# EAGLE design vape_v3_logic (EAGLE 9.0.0)

## Sheet 1 of 7: Notes
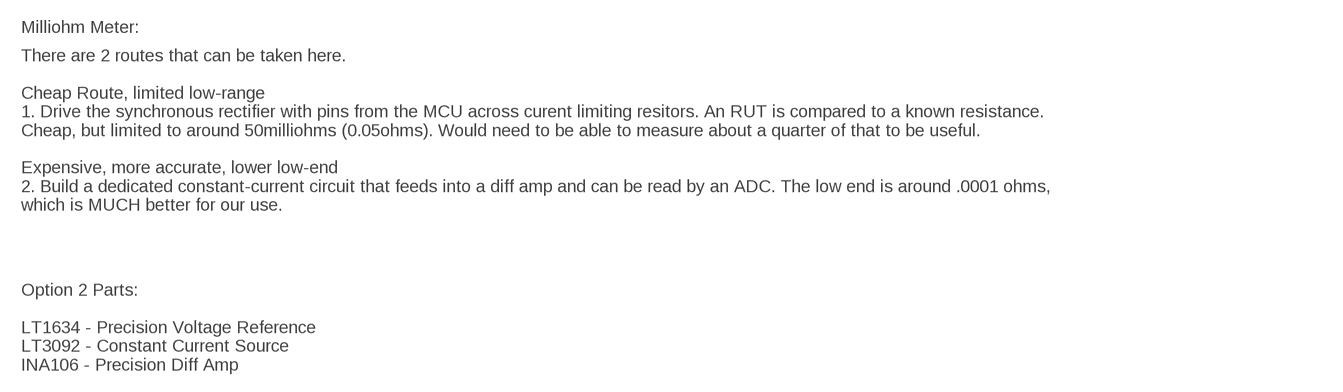
[diagram p0: schematic, sheet 1]

### Notes on the sheet
- Milliohm Meter:
- There are 2 routes that can be taken here. 
  
  Cheap Route, limited low-range
  1. Drive the synchronous rectifier with pins from the MCU across curent limiting resitors. An RUT is compared to a known resistance. 
  Cheap, but limited to around 50milliohms (0.05ohms). Would need to be able to measure about a quarter of that to be useful.
  
  Expensive, more accurate, lower low-end
  2. Build a dedicated constant-current circuit that feeds into a diff amp and can be read by an ADC. The low end is around .0001 ohms, 
  which is MUCH better for our use.
- Option 2 Parts:
  
  LT1634 - Precision Voltage Reference
  LT3092 - Constant Current Source
  INA106 - Precision Diff Amp

## Sheet 2 of 7: 5V Rail
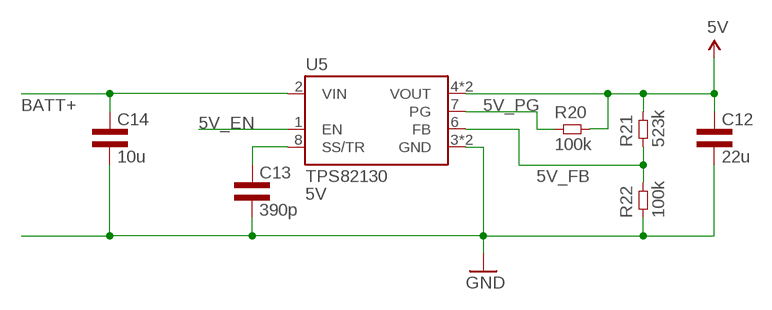
[diagram p1: schematic, sheet 2]

### Parts
C12  22u  CAP1206L3  [1206L3]
C13  390p  CAP0603L3  [0603L3]
C14  10u  CAP0805L3  [0805L3]
R20  100k  RES0805L3  [0805L3]
R21  523k  RES0603L3  [0603L3]
R22  100k  RES0603L3  [0603L3]
U5  TPS82130  [SIL0008D]

### Nets
5V: C12.1 R20.2 R21.P$2 U5.4(VOUT) U5.5(VOUT)
5V_EN: U5.1(EN)
5V_FB: R21.P$1 R22.P$2 U5.6(FB)
5V_PG: R20.1 U5.7(PG)
5V_SS: C13.P$1 U5.8(SS/TR)
BATT+: C14.1 U5.2(VIN) ; also sheet 3,7
GND: C12.2 C13.P$2 C14.2 R22.P$1 U5.3(GND) U5.TP(GND) ; also sheet 3,4,5,6,7

## Sheet 3 of 7: 3V3 Rail
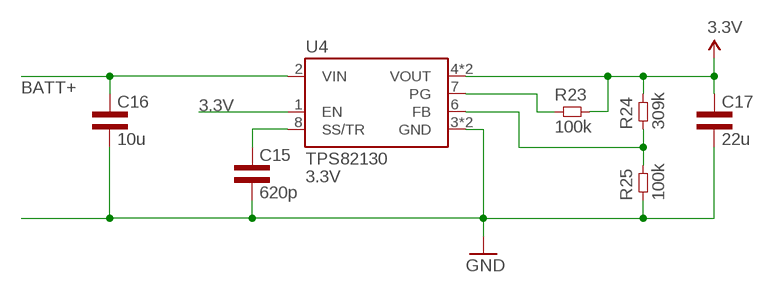
[diagram p2: schematic, sheet 3]

### Parts
C15  620p  CAP0603L3  [0603L3]
C16  10u  CAP0805L3  [0805L3]
C17  22u  CAP1206L3  [1206L3]
R23  100k  RES0805L3  [0805L3]
R24  309k  RES0603L3  [0603L3]
R25  100k  RES0603L3  [0603L3]
U4  TPS82130  [SIL0008D]

### Nets
3.3V: C17.1 R23.2 R24.P$2 U4.1(EN) U4.4(VOUT) U4.5(VOUT) ; also sheet 4,6
BATT+: C16.1 U4.2(VIN) ; also sheet 2,7
GND: C15.P$2 C16.2 C17.2 R25.P$1 U4.3(GND) U4.TP(GND) ; also sheet 2,4,5,6,7
N$7: R23.1 U4.7(PG)
N$9: R24.P$1 R25.P$2 U4.6(FB)
N$12: C15.P$1 U4.8(SS/TR)

## Sheet 4 of 7
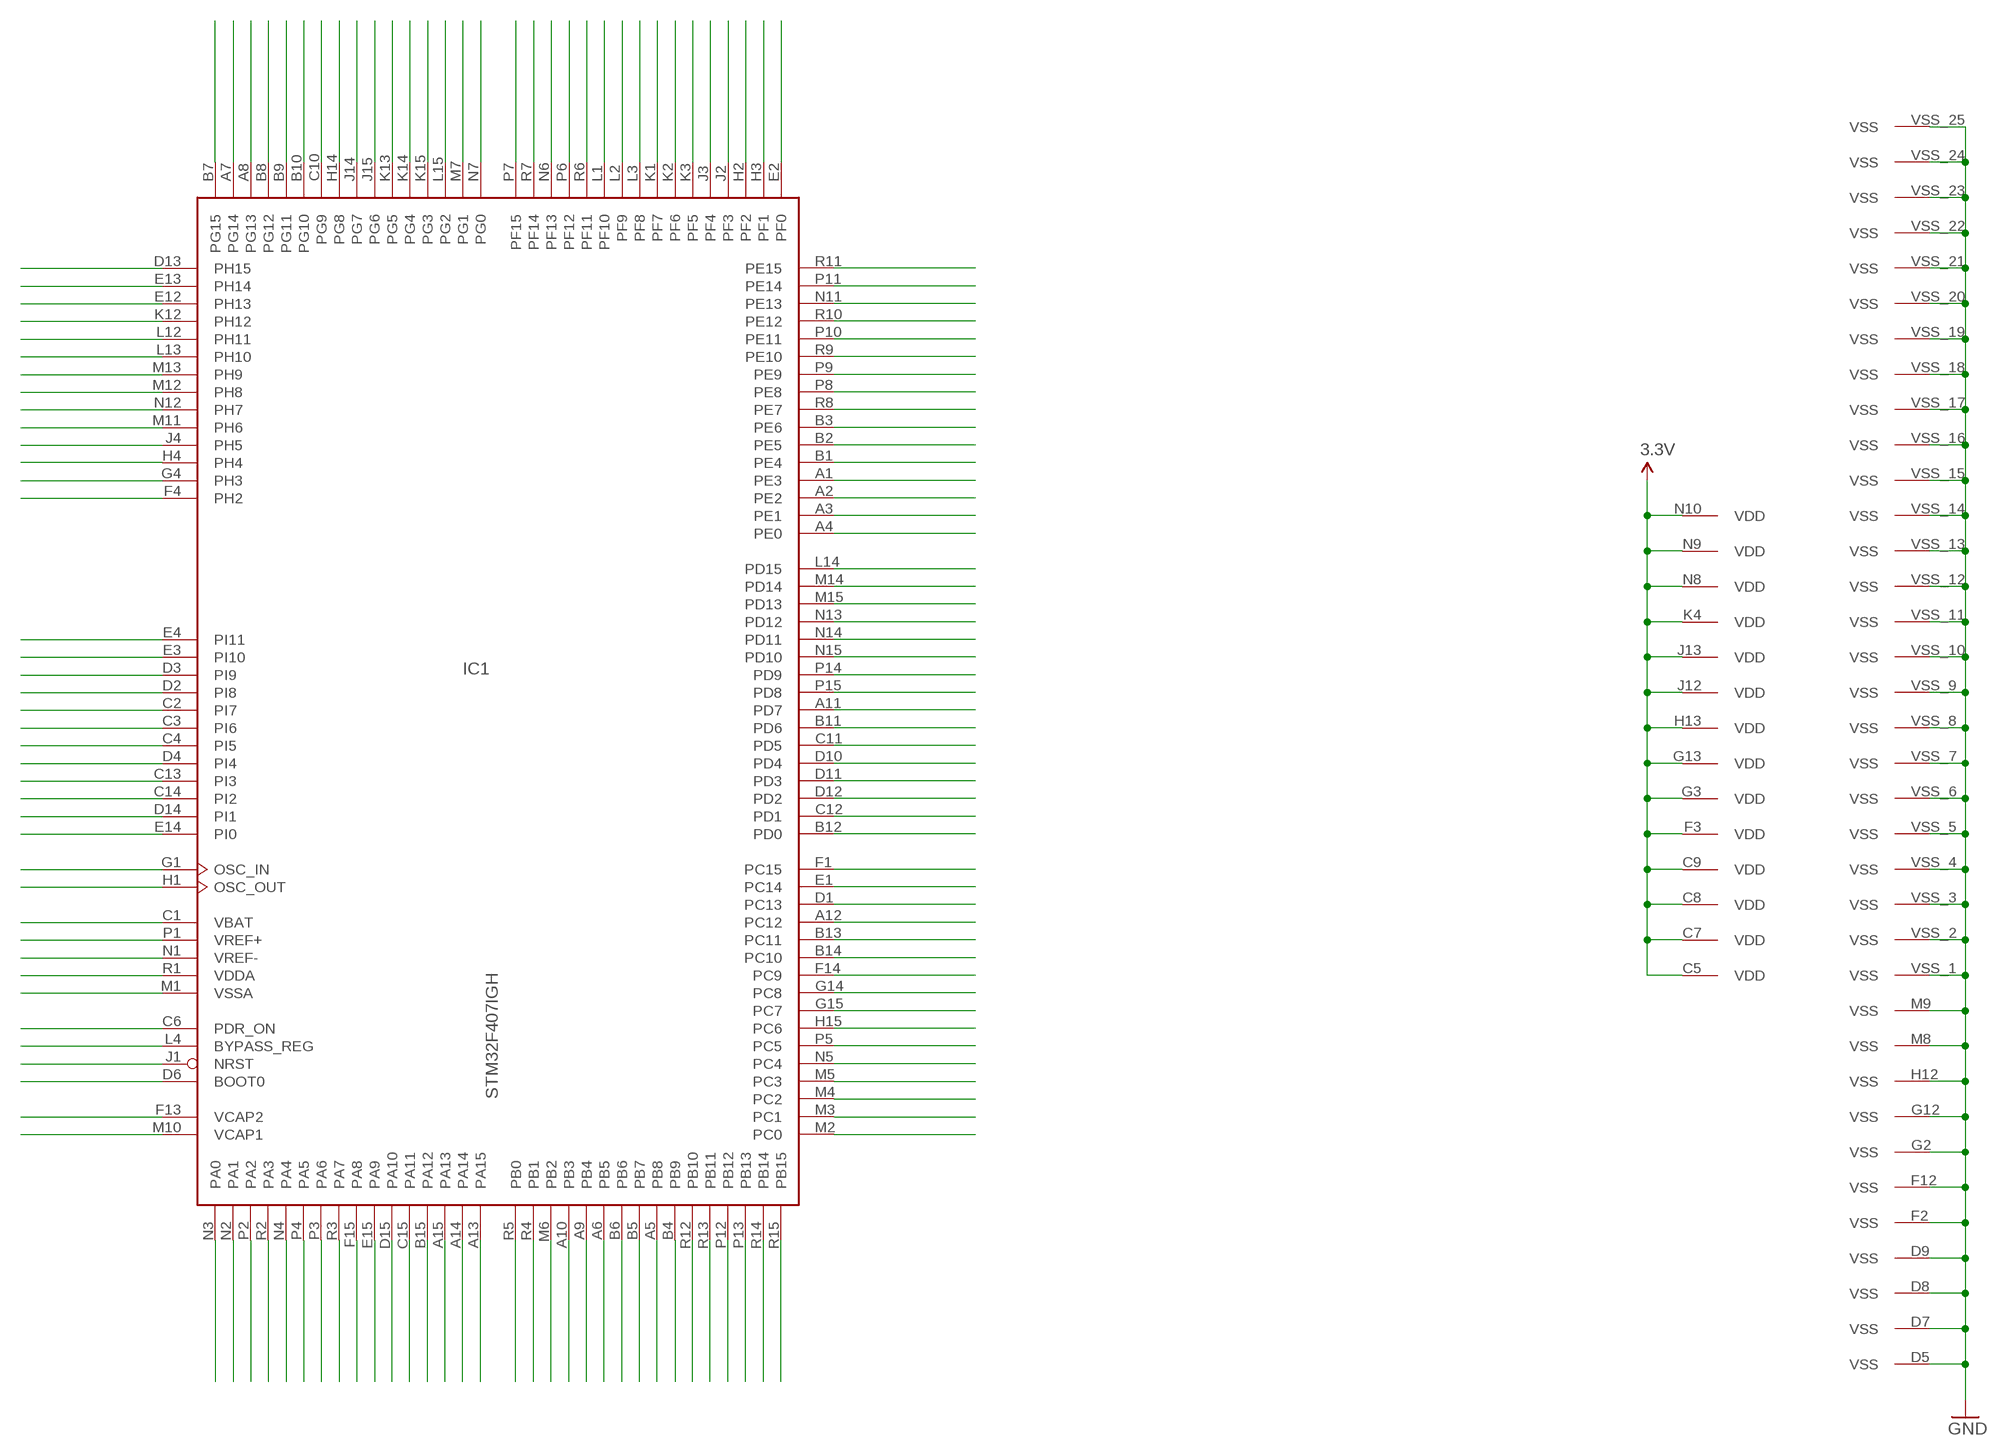
[diagram p3: schematic, sheet 4]

### Parts
IC1  STM32F407IGH  [UFBGA176+25]

### Nets
3.3V: IC1.C5(VDD) IC1.C7(VDD) IC1.C8(VDD) IC1.C9(VDD) IC1.F3(VDD) IC1.G3(VDD) IC1.G13(VDD) IC1.H13(VDD) IC1.J12(VDD) IC1.J13(VDD) IC1.K4(VDD) IC1.N8(VDD) IC1.N9(VDD) IC1.N10(VDD) ; also sheet 3,6
GND: IC1.D5(VSS) IC1.D7(VSS) IC1.D8(VSS) IC1.D9(VSS) IC1.F2(VSS) IC1.F12(VSS) IC1.G2(VSS) IC1.G12(VSS) IC1.H12(VSS) IC1.M8(VSS) IC1.M9(VSS) IC1.VSS_1(VSS) IC1.VSS_2(VSS) IC1.VSS_3(VSS) IC1.VSS_4(VSS) IC1.VSS_5(VSS) IC1.VSS_6(VSS) IC1.VSS_7(VSS) IC1.VSS_8(VSS) IC1.VSS_9(VSS) IC1.VSS_10(VSS) IC1.VSS_11(VSS) IC1.VSS_12(VSS) IC1.VSS_13(VSS) IC1.VSS_14(VSS) IC1.VSS_15(VSS) IC1.VSS_16(VSS) IC1.VSS_17(VSS) IC1.VSS_18(VSS) IC1.VSS_19(VSS) IC1.VSS_20(VSS) IC1.VSS_21(VSS) IC1.VSS_22(VSS) IC1.VSS_23(VSS) IC1.VSS_24(VSS) IC1.VSS_25(VSS) ; also sheet 2,3,5,6,7
N$8: IC1.P14(PD9)
N$11: IC1.N15(PD10)
N$13: IC1.N14(PD11)
N$17: IC1.N13(PD12)
N$18: IC1.M15(PD13)
N$22: IC1.M14(PD14)
N$24: IC1.L14(PD15)
N$25: IC1.P15(PD8)
N$26: IC1.A11(PD7)
N$27: IC1.B11(PD6)
N$29: IC1.C11(PD5)
N$30: IC1.D10(PD4)
N$33: IC1.D11(PD3)
N$34: IC1.D12(PD2)
N$35: IC1.C12(PD1)
N$36: IC1.B12(PD0)
N$37: IC1.F1(PC15)
N$38: IC1.E1(PC14)
N$39: IC1.D1(PC13)
N$40: IC1.A12(PC12)
N$41: IC1.B13(PC11)
N$42: IC1.B14(PC10)
N$43: IC1.F14(PC9)
N$44: IC1.G14(PC8)
N$45: IC1.G15(PC7)
N$46: IC1.H15(PC6)
N$47: IC1.P5(PC5)
N$48: IC1.N5(PC4)
N$49: IC1.M5(PC3)
N$50: IC1.M4(PC2)
N$51: IC1.M3(PC1)
N$52: IC1.M2(PC0)
N$53: IC1.A4(PE0)
N$54: IC1.A3(PE1)
N$55: IC1.A2(PE2)
N$56: IC1.A1(PE3)
N$57: IC1.B1(PE4)
N$58: IC1.B2(PE5)
N$59: IC1.B3(PE6)
N$60: IC1.R8(PE7)
N$61: IC1.P8(PE8)
N$62: IC1.P9(PE9)
N$63: IC1.R9(PE10)
N$64: IC1.P10(PE11)
N$65: IC1.R10(PE12)
N$66: IC1.N11(PE13)
N$67: IC1.P11(PE14)
N$68: IC1.R11(PE15)
N$69: IC1.R15(PB15)
N$70: IC1.R14(PB14)
N$71: IC1.P13(PB13)
N$72: IC1.P12(PB12)
N$73: IC1.R13(PB11)
N$74: IC1.R12(PB10)
N$75: IC1.B4(PB9)
N$76: IC1.A5(PB8)
N$77: IC1.B5(PB7)
N$78: IC1.B6
N$79: IC1.A6(PB5)
N$80: IC1.A9(PB4)
N$81: IC1.A10(PB3)
N$82: IC1.M6(PB2)
N$83: IC1.R4(PB1)
N$84: IC1.R5(PB0)
N$85: IC1.A13(PA15)
N$86: IC1.A14
N$87: IC1.A15(PA13)
N$88: IC1.B15(PA12)
N$89: IC1.C15(PA11)
N$90: IC1.D15(PA10)
N$91: IC1.E15(PA9)
N$92: IC1.F15(PA8)
N$93: IC1.R3(PA7)
N$94: IC1.P3(PA6)
N$95: IC1.P4(PA5)
N$96: IC1.N4(PA4)
N$97: IC1.R2(PA3)
N$98: IC1.P2(PA2)
N$99: IC1.N2(PA1)
N$100: IC1.N3(PA0)
N$101: IC1.M10(VCAP1)
N$102: IC1.F13(VCAP2)
N$103: IC1.D6(BOOT0)
N$104: IC1.J1(NRST)
N$105: IC1.L4(BYPASS_REG)
N$106: IC1.C6(PDR_ON)
N$107: IC1.M1(VSSA)
N$108: IC1.R1(VDDA)
N$109: IC1.N1(VREF-)
N$110: IC1.P1(VREF+)
N$111: IC1.C1(VBAT)
N$112: IC1.H1(OSC_OUT)
N$113: IC1.G1(OSC_IN)
N$114: IC1.E14(PI0)
N$115: IC1.D14(PI1)
N$116: IC1.C14(PI2)
N$117: IC1.C13(PI3)
N$118: IC1.D4(PI4)
N$119: IC1.C4(PI5)
N$120: IC1.C3(PI6)
N$121: IC1.C2(PI7)
N$122: IC1.D2(PI8)
N$123: IC1.D3(PI9)
N$124: IC1.E3(PI10)
N$125: IC1.E4(PI11)
N$126: IC1.F4(PH2)
N$127: IC1.G4(PH3)
N$128: IC1.H4
N$129: IC1.J4(PH5)
N$130: IC1.M11(PH6)
N$131: IC1.N12(PH7)
N$132: IC1.M12(PH8)
N$133: IC1.M13(PH9)
N$134: IC1.L13(PH10)
N$135: IC1.L12(PH11)
N$136: IC1.K12(PH12)
N$137: IC1.E12(PH13)
N$138: IC1.E13(PH14)
N$139: IC1.D13(PH15)
N$140: IC1.E2(PF0)
N$141: IC1.H3(PF1)
N$142: IC1.H2(PF2)
N$143: IC1.J2(PF3)
N$144: IC1.J3(PF4)
N$145: IC1.K3(PF5)
N$146: IC1.K2(PF6)
N$147: IC1.K1(PF7)
N$148: IC1.L3(PF8)
N$149: IC1.L2(PF9)
N$150: IC1.L1(PF10)
N$151: IC1.R6(PF11)
N$152: IC1.P6(PF12)
N$153: IC1.N6(PF13)
N$154: IC1.R7(PF14)
N$155: IC1.P7(PF15)
N$156: IC1.N7(PG0)
N$157: IC1.M7(PG1)
N$158: IC1.L15(PG2)
N$159: IC1.K15(PG3)
N$160: IC1.K14(PG4)
N$161: IC1.K13(PG5)
N$162: IC1.J15(PG6)
N$163: IC1.J14(PG7)
N$164: IC1.H14(PG8)
N$165: IC1.C10(PG9)
N$166: IC1.B10(PG10)
N$167: IC1.B9(PG11)
N$168: IC1.B8(PG12)
N$169: IC1.A8(PG13)
N$170: IC1.A7(PG14)
N$171: IC1.B7(PG15)

## Sheet 5 of 7: Milliohm Meter
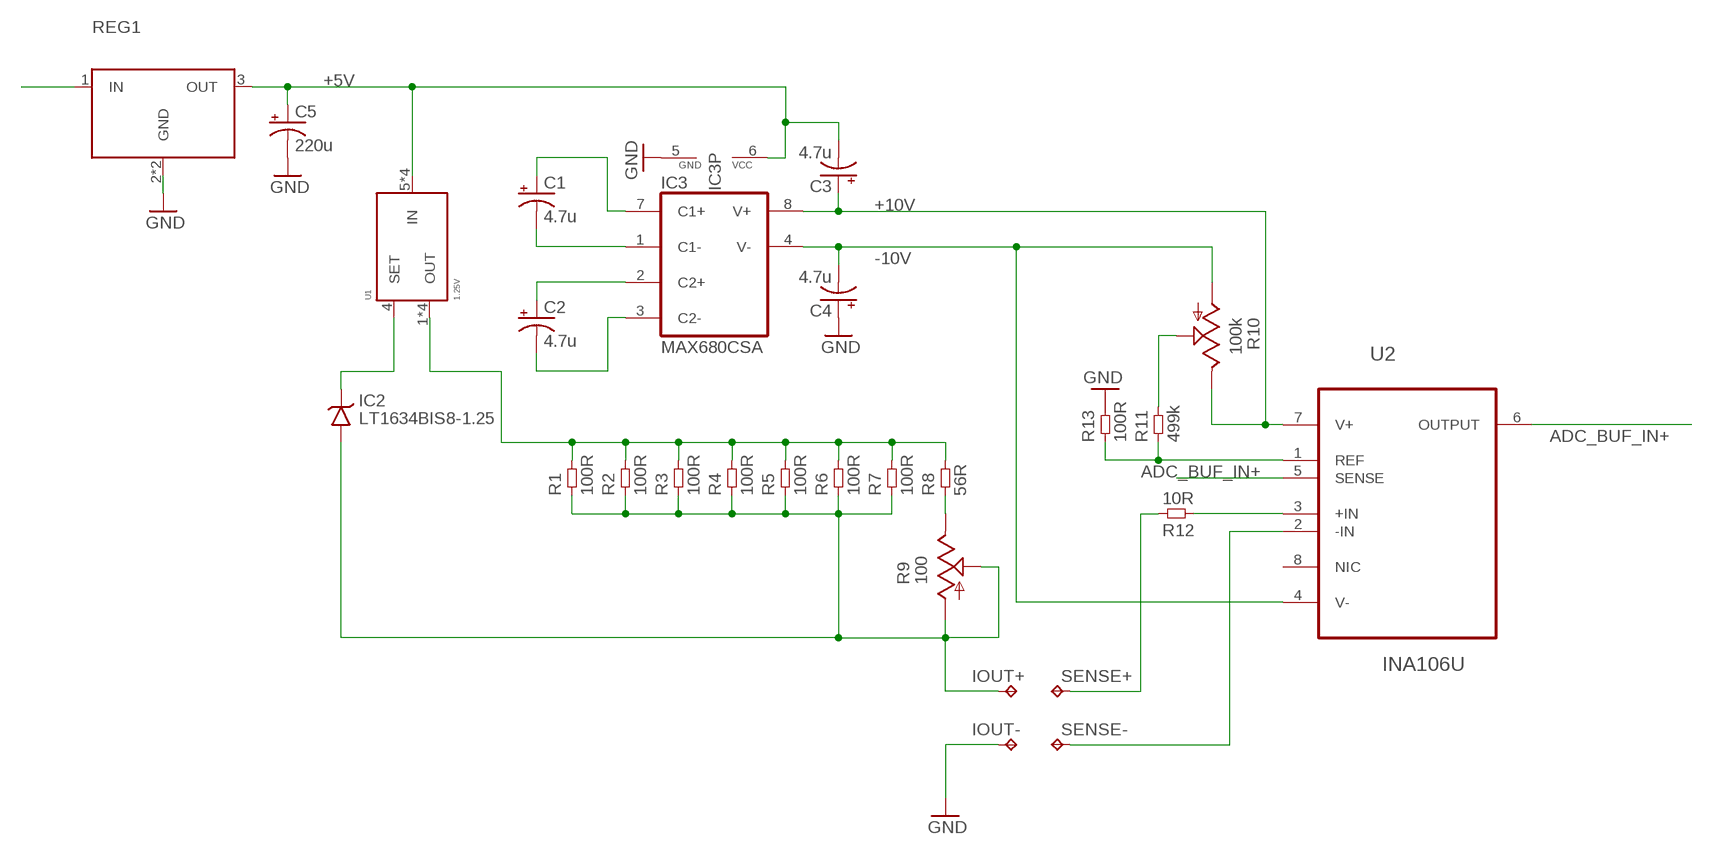
[diagram p4: schematic, sheet 5]

### Parts
C1  4.7u  CPOL-USB/3528-21R  [B/3528-21R]
C2  4.7u  CPOL-USB/3528-21R  [B/3528-21R]
C3  4.7u  CPOL-USB/3528-21R  [B/3528-21R]
C4  4.7u  CPOL-USB/3528-21R  [B/3528-21R]
C5  220u  CPOL-USC  [PANASONIC_C]
IC2  LT1634BIS8-1.25  [S8]
IC3  MAX680CSA  [SO08]
IOUT+  TPPAD1-17  [P1-17]
IOUT-  TPPAD1-17  [P1-17]
R1  100R  RES0603L3  [0603L3]
R2  100R  RES0603L3  [0603L3]
R3  100R  RES0603L3  [0603L3]
R4  100R  RES0603L3  [0603L3]
R5  100R  RES0603L3  [0603L3]
R6  100R  RES0603L3  [0603L3]
R7  100R  RES0603L3  [0603L3]
R8  56R  RES0603L3  [0603L3]
R9  100  TRIM_US-3223W  [3223W]
R10  100k  TRIM_US-3223W  [3223W]
R11  499k  RES0603L3  [0603L3]
R12  10R  RES0603L3  [0603L3]
R13  100R  RES0603L3  [0603L3]
REG1  LDO_REG_4PIN  [SOT-223-3]
SENSE+  TPPAD1-17  [P1-17]
SENSE-  TPPAD1-17  [P1-17]
U1  1.25V  LT3092  [DD-8]
U2  INA106U  [SOIC127P600X175-8N]

### Nets
+5V: C3.- C5.+ IC3.6(VCC) REG1.3(OUT) U1.5(IN) U1.6(IN) U1.7(IN) U1.8(IN)
+10V: C3.+ IC3.8(V+) R10.3(E) U2.7(V+)
-10V: C4.- IC3.4(V-) R10.1(A) U2.4(V-)
ADC_BUF_IN+: U2.5(SENSE) U2.6(OUTPUT) ; also sheet 6
CC: IC2.4(GND) IOUT+.TP R1.P$1 R2.P$1 R3.P$1 R4.P$1 R5.P$1 R6.P$1 R7.P$1 R9.1(A) R9.2(S)
CC_OUT: R1.P$2 R2.P$2 R3.P$2 R4.P$2 R5.P$2 R6.P$2 R7.P$2 R8.P$2 U1.1(OUT) U1.2(OUT) U1.3(OUT) U1.9(OUT)
GND: C4.+ C5.- IC3.5(GND) IOUT-.TP R13.P$2 REG1.2(GND) REG1.4(GND) ; also sheet 2,3,4,6,7
MEAS_NEG: SENSE-.TP U2.2(-IN)
MEAS_POS: R12.P$2 SENSE+.TP
N$1: IC2.6(VOUT) U1.4(SET)
N$2: C1.- IC3.1(C1-)
N$3: C2.+ IC3.2(C2+)
N$4: C1.+ IC3.7(C1+)
N$5: C2.- IC3.3(C2-)
N$6: R12.P$1 U2.3(+IN)
N$10: R8.P$1 R9.3(E)
N$14: R11.P$1 R13.P$1 U2.1(REF)
N$15: R10.2(S) R11.P$2
V_IN: REG1.1(IN)
Unconnected: U2.8(NIC)

## Sheet 6 of 7: Milliohm ADC
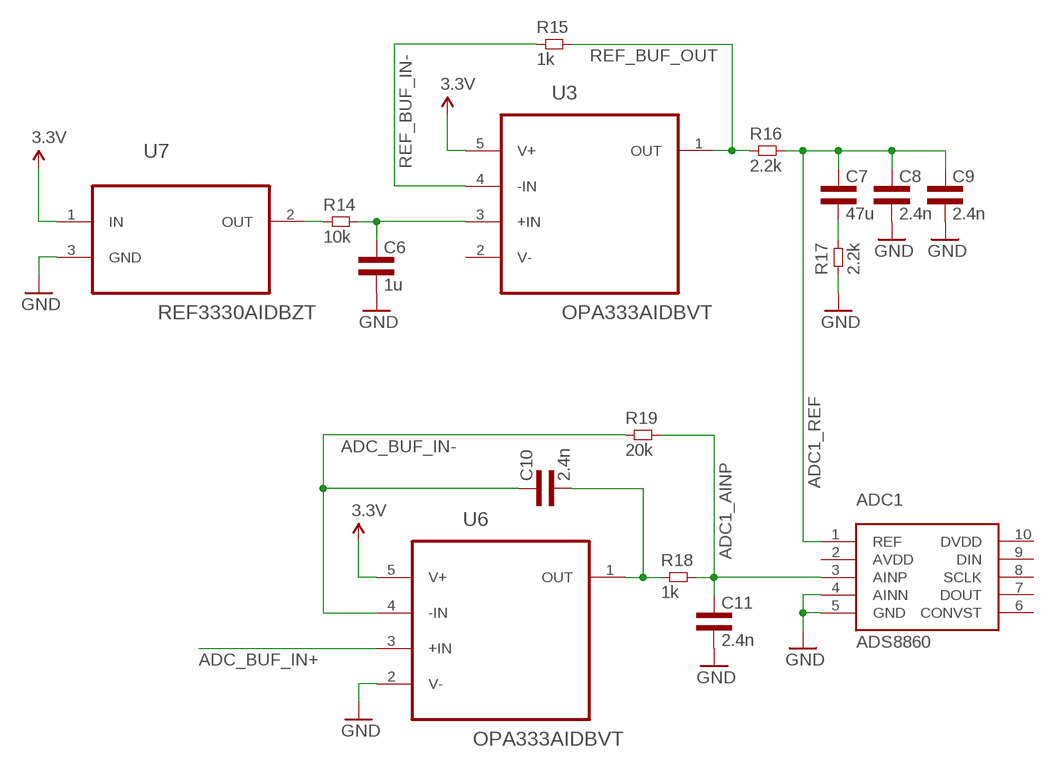
[diagram p5: schematic, sheet 6]

### Parts
ADC1  ADS8860IDGSR  [S-PDSO-G10]
C6  1u  CAP0603L3  [0603L3]
C7  47u  CAP0805L3  [0805L3]
C8  2.4n  CAP0603L3  [0603L3]
C9  2.4n  CAP0603L3  [0603L3]
C10  2.4n  CAP0603L3  [0603L3]
C11  2.4n  CAP0603L3  [0603L3]
R14  10k  RES0603L3  [0603L3]
R15  1k  RES0603L3  [0603L3]
R16  2.2k  RES0603L3  [0603L3]
R17  2.2k  RES0603L3  [0603L3]
R18  1k  RES0603L3  [0603L3]
R19  20k  RES0603L3  [0603L3]
U3  OPA333AIDBVT  [SOT95P280X145-5N]
U6  OPA333AIDBVT  [SOT95P280X145-5N]
U7  REF3330AIDBZT  [SOT95P237X112-3N]

### Nets
3.3V: U3.5(V+) U6.5(V+) U7.1(IN) ; also sheet 3,4
ADC1_AINP: ADC1.3(AINP) C11.P$1 R18.P$2 R19.P$2
ADC1_REF: ADC1.1(REF) C7.1 C8.P$1 C9.P$1 R16.P$2
ADC_BUF_IN+: U6.3(+IN) ; also sheet 5
ADC_BUF_IN-: C10.P$1 R19.P$1 U6.4(-IN)
ADC_BUF_OUT: C10.P$2 R18.P$1 U6.1(OUT)
GND: ADC1.4(AINN) ADC1.5(GND) C6.P$2 C8.P$2 C9.P$2 C11.P$2 R17.P$1 U6.2(V-) U7.3(GND) ; also sheet 2,3,4,5,7
N$16: C7.2 R17.P$2
REF_BUF_IN+: C6.P$1 R14.P$2 U3.3(+IN)
REF_BUF_IN-: R15.P$1 U3.4(-IN)
REF_BUF_OUT: R15.P$2 R16.P$1 U3.1(OUT)
REF_OUT: R14.P$1 U7.2(OUT)
Unconnected: ADC1.2(AVDD) ADC1.6(CONVST) ADC1.7(DOUT) ADC1.8(SCLK) ADC1.9(DIN) ADC1.10(DVDD)

## Sheet 7 of 7: MosFET Gate Driver
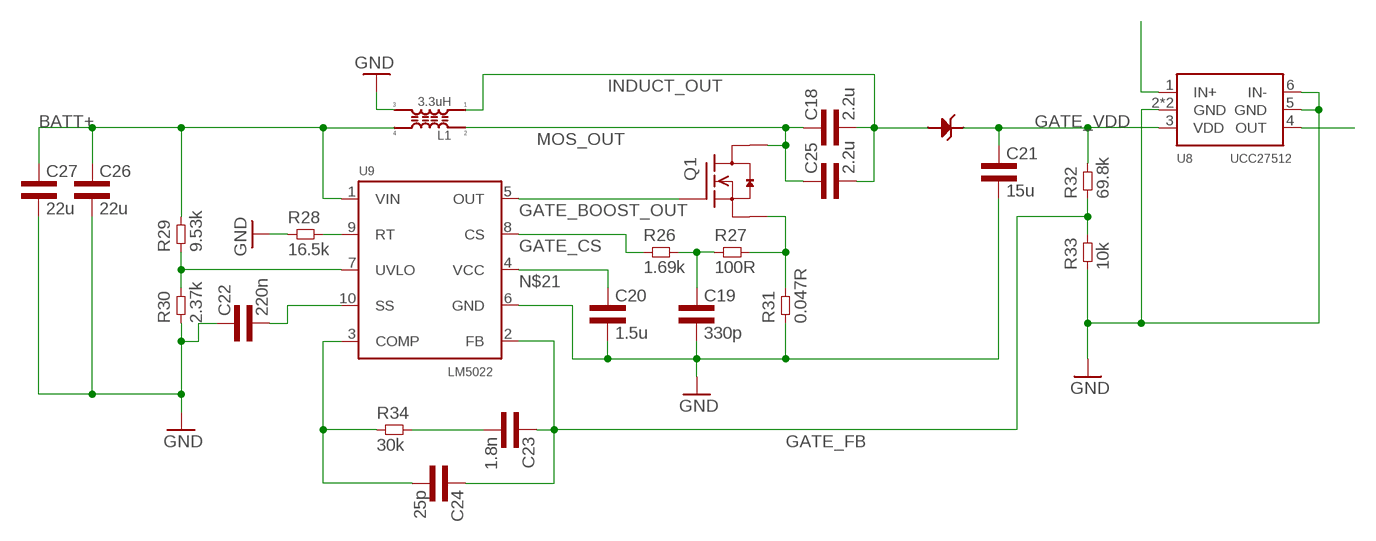
[diagram p6: schematic, sheet 7]

### Parts
C18  2.2u  CAP0402L3  [0402L3]
C19  330p  CAP0402L3  [0402L3]
C20  1.5u  CAP0402L3  [0402L3]
C21  15u  CAP1206L3  [1206L3]
C22  220n  CAP0402L3  [0402L3]
C23  1.8n  CAP0402L3  [0402L3]
C24  25p  CAP0402L3  [0402L3]
C25  2.2u  CAP0402L3  [0402L3]
C26  22u  CAP1206L3  [1206L3]
C27  22u  CAP1206L3  [1206L3]
D1  .77V / 5.5A  SCHOTTKYDIODEDPAK  [DPAK]
L1  3.3uH  DRQ127  [DRQ12X]
Q1  OPEN-BLDC_FDMC7664  [OPEN-BLDC_MLP33]
R26  1.69k  RES0402L3  [0402L3]
R27  100R  RES0402L3  [0402L3]
R28  16.5k  RES0402L3  [0402L3]
R29  9.53k  RES0402L3  [0402L3]
R30  2.37k  RES0402L3  [0402L3]
R31  0.047R  RES1206L3  [1206L3]
R32  69.8k  RES0402L3  [0402L3]
R33  10k  RES0402L3  [0402L3]
R34  30k  RES0402L3  [0402L3]
U8  UCC27512  [S-PWSON-N6]
U9  LM5022  [S-PDSO-G10]

### Nets
BATT+: C26.1 C27.1 L1.4 R29.P$2 U9.1(VIN) ; also sheet 2,3
GATE_BOOST_OUT: Q1.4G(G) U9.5(OUT)
GATE_COMP: C24.P$2 R34.P$1 U9.3(COMP)
GATE_CS: R26.P$1 U9.8(CS)
GATE_FB: C23.P$1 C24.P$1 R32.P$1 R33.P$2 U9.2(FB)
GATE_SS: C22.P$2 U9.10(SS)
GATE_UVLO: R29.P$1 R30.P$2 U9.7(UVLO)
GATE_VDD: C21.1 D1.TAB(CATHODE) R32.P$2 U8.3(VDD)
GND: C19.P$2 C20.P$2 C21.2 C22.P$1 C26.2 C27.2 L1.3 R28.P$1 R30.P$1 R31.1 R33.P$1 U8.2(GND) U8.5(GND) U8.6(IN-) U8.TP(GND) U9.6(GND) ; also sheet 2,3,4,5,6
INDUCT_OUT: C18.P$2 C25.P$2 D1.1(ANODE) D1.3(ANODE) L1.1
MOS_OUT: C18.P$1 C25.P$1 L1.2 Q1.5678D(D)
N$19: C19.P$1 R26.P$2 R27.P$1
N$20: Q1.123S(S) R27.P$2 R31.2
N$21: C20.P$1 U9.4(VCC)
N$23: R28.P$2 U9.9(RT)
N$28: C23.P$2 R34.P$2
N$31: U8.1(IN+)
N$32: U8.4(OUT)

## Power pins joined to a net without a drawn wire
V-: U3.2(V-)

## Library data of the parts
ADC1 = common:ADS8860: Analog to Digital converter: - 1MSPS - 16-Bit - Single Channel - Differential Input - 2.7 - 3.6V Analog Supply - 1.65 - 3.6V Digital Supply - External Reference - 93dB SNR
C1-C4 = rcl:CPOL-US: POLARIZED CAPACITOR, American symbol; PART#: T521B475M035ATE150
C5 = rcl:CPOL-US: POLARIZED CAPACITOR, American symbol
C6 C8-C27 = common:CAP
C7 = common:CAP; PART#: C2012JB1A476M125AC
D1 = common:SCHOTTKYDIODE
IC1 = micro-stm_v3:STM32F407I*H: ARM 32-bit Cortex™-M3 CPU 168 MHz maximum frequency 512 to 1024 Kbytes of Flash memory 192 kbytes of SRAM 140 GPIOs 1.8 to 3.6 V application supply
IC2 = linear-technology:LT1634: Micropower Precision Shunt Voltage Reference Source: Darta sheet <http://cds.linear.com/docs/en/datasheet/1634fe.pdf>
IC3 = maxim:MAX680CSA: Switched-capcitor VOLTAGE CONVERTER; MF: MAXIM; MPN: MAX680CSA; OC_FARNELL: 9725717; OC_NEWARK: 34C3975
IOUT+ IOUT- SENSE+ SENSE- = testpad:TP: Test pad
L1 = common:DRQ127
Q1 = power:OPEN-BLDC_FDMC7664
R1-R8 = common:RES; PART#: APC0603T100RZ
R9 R10 = pot:TRIM_US-: POTENTIOMETER
R11-R34 = common:RES
REG1 = common:LDO_REG_4PIN
U1 = common:LT3092
U2 = Texas Instruments_By_element14_Batch_1:INA106U: DIFFERENTIAL AMPLIFIER; MPN: INA106U; OC_FARNELL: 1212395; OC_NEWARK: 74C9754; PACKAGE: SOIC-8; SUPPLIER: TI
U3 U6 = Texas Instruments_By_element14_Batch_1:OPA333AIDBVT: 1.8V, microPOWER CMOS OPERATIONAL AMPLIFIERS Zerø-Drift Series; MPN: OPA333AIDBVT; OC_FARNELL: 1273121; OC_NEWARK: 80K2659; PACKAGE: SOT-23-5; SUPPLIER: Texas Instruments
U4 = common:TPS82130; VOUT: 3.3V
U5 = common:TPS82130; VOUT: 5V
U7 = Texas Instruments_By_element14_Batch_1:REF3330AIDBZT: VOLTAGE REFERENCE; MPN: REF3330AIDBZT; OC_FARNELL: 1755084; OC_NEWARK: 58M1127; PACKAGE: SOT-23-3; SUPPLIER: Texas Instruments
U8 = micro-stm_v3:UCC27512
U9 = common:LM5022

## Board
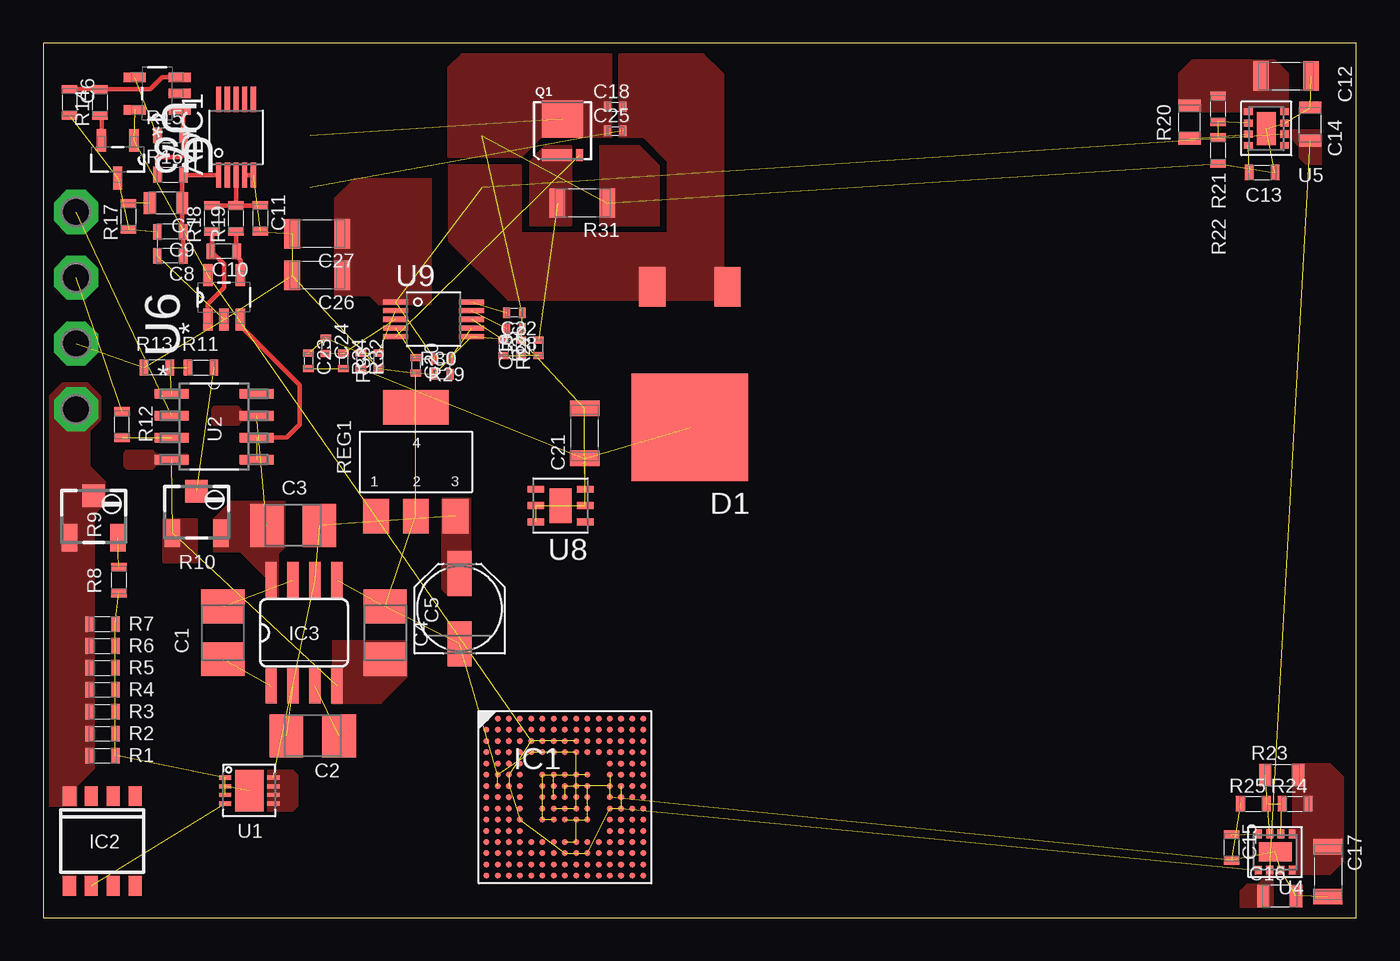
[diagram p7: board, top side]
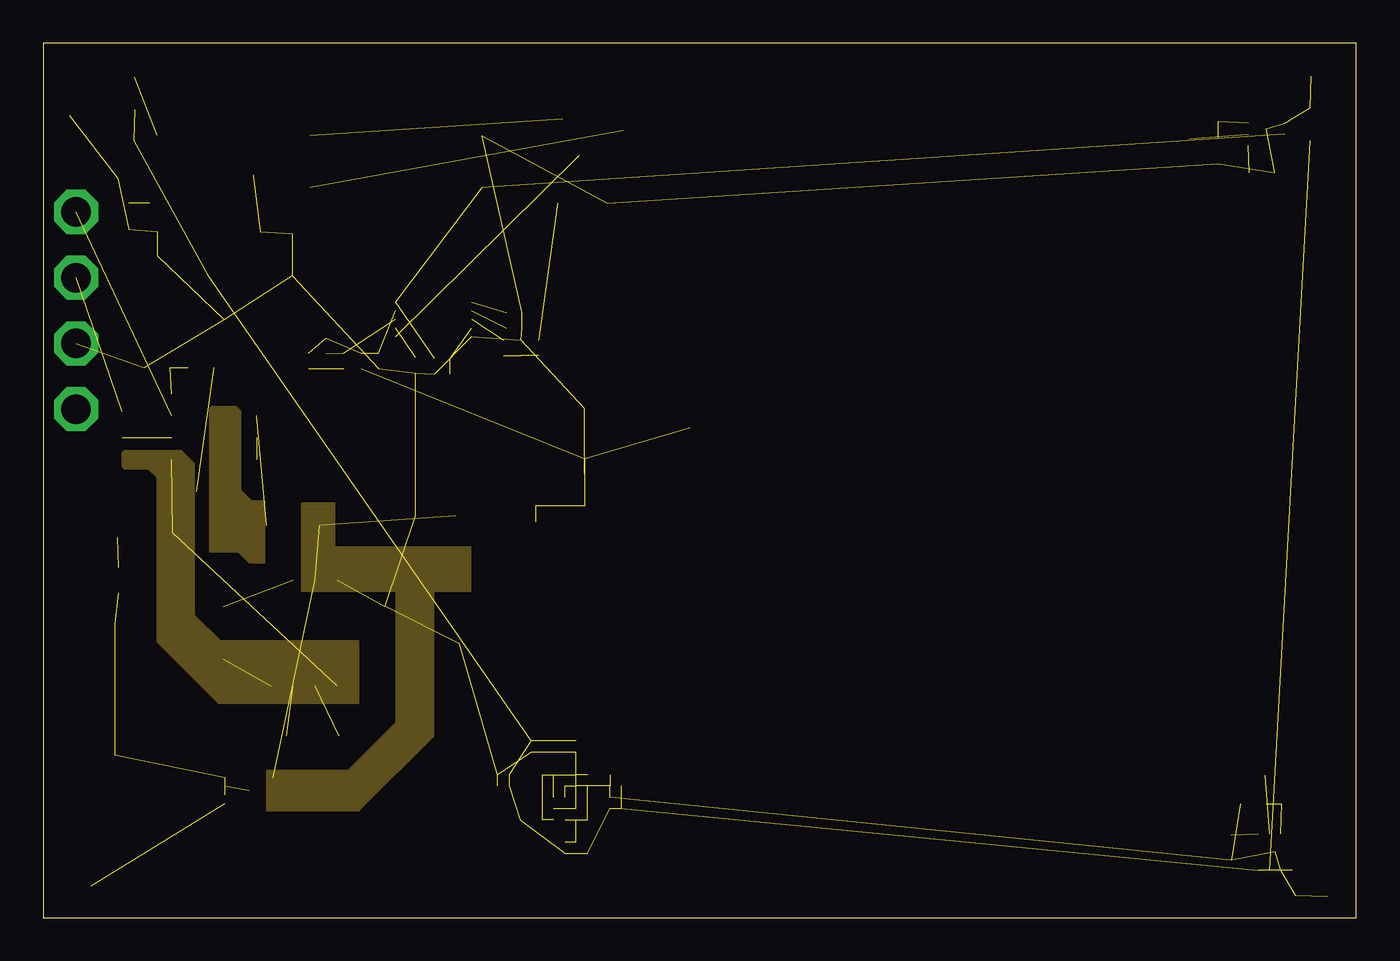
[diagram p8: board, inner layer Route3]
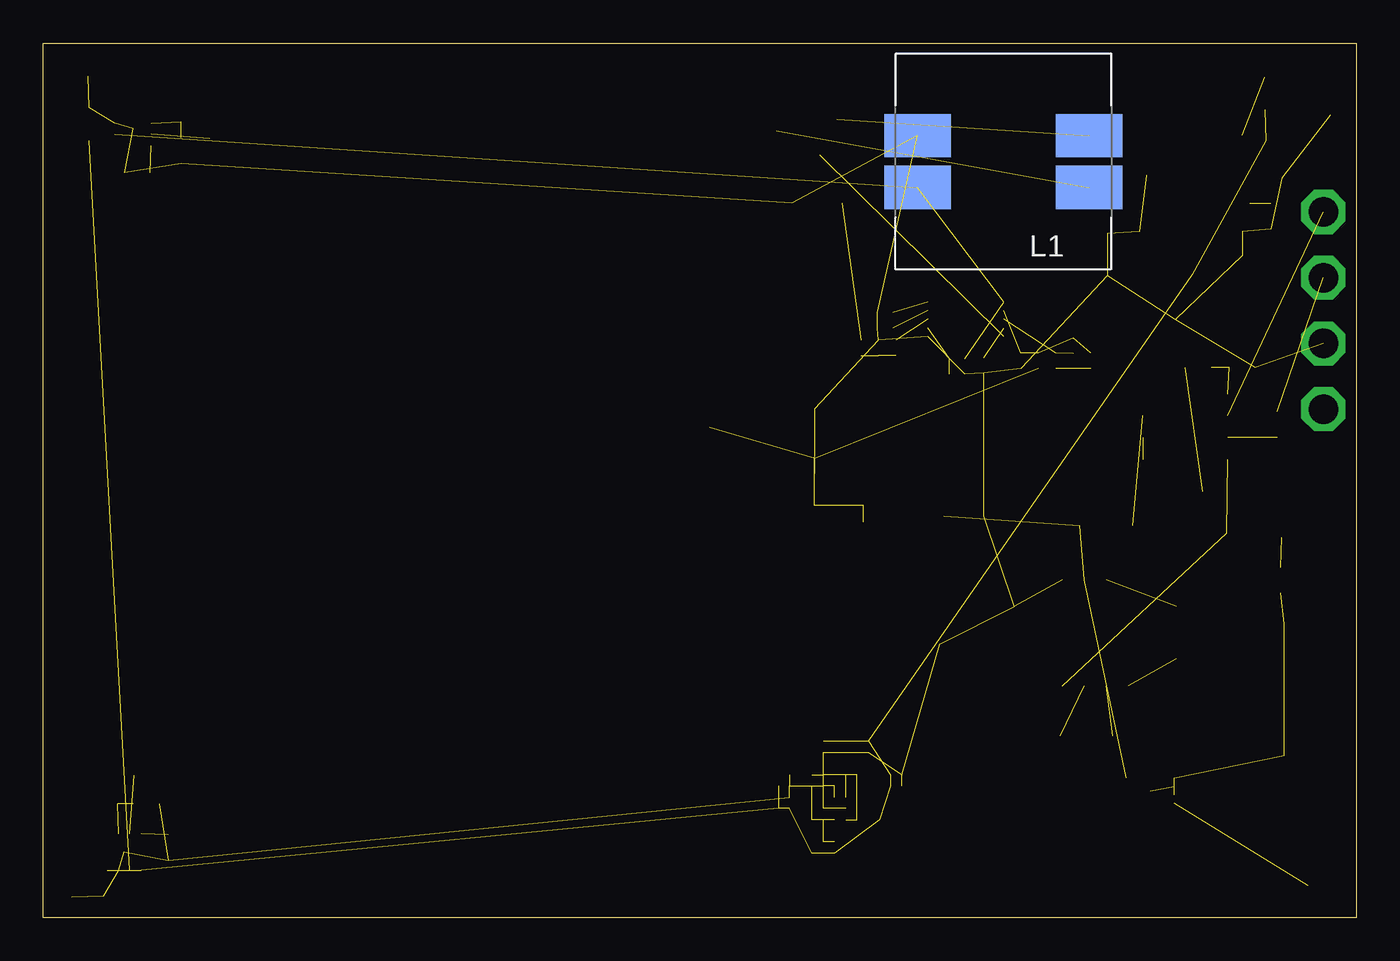
[diagram p9: board, bottom side, seen from below]

Size 76.07 x 50.67 mm. Coordinates in mm from the lower left corner, seen from the top.
Outline: 0,0 76.07,0 76.07,50.67 0,50.67 0,0
Copper layers (1*2*3*16): Top 0.035mm / dielectric 1.5mm / Route2 0.035mm / dielectric 0.15mm / Route3 0.035mm / dielectric 0.2mm / Bottom 0.035mm
Design rules "osh_park_4-layer": minimum track width 5mil, minimum drill 10mil, track to track 5mil, track to pad 5mil, pad to pad 5mil, via to via 5mil, smd to smd 0mil, copper to edge 13mil, drill to drill 8mil, minimum pad ring 4mil, minimum via ring 4mil, stop-mask expansion 4mil, vias tented up to drill 0mil, thermal gap 10mil

### Footprints (pad centres in the part's own frame; a part is rotated, then mirrored left to right if it is on the bottom)
S-PDSO-G10 = smd 0.3 x 1.45: 1 -1,-2.2; 2 -0.5,-2.2; 3 0,-2.2; 4 0.5,-2.2; 5 1,-2.2; 6 1,2.2; 7 0.5,2.2; 8 0,2.2; 9 -0.5,2.2; 10 -1,2.2
B/3528-21R = smd 1.95 x 2.5: + 1.525,0; - -1.525,0
PANASONIC_C = smd 2.6 x 1.4: + 2.05,0; - -2.05,0
0603L3 = smd 0.5 x 0.9: P$1 -0.75,0; P$2 0.75,0
0805L3 = smd 0.7 x 1.3: 1 -0.95,0; 2 0.95,0
1206L3 = smd 0.9 x 1.7: 1 -1.45,0; 2 1.45,0
0402L3 = smd 0.4 x 0.6: P$1 -0.45,0; P$2 0.45,0
DPAK = smd 1.524 x 2.28: 1 -2.18,-5.06; 3 2.18,-5.06 | smd 6.74 x 6.23: TAB 0,3.085
UFBGA176+25 = smd 0.35 x 0.35: A1 -4.55,4.55; A2 -3.9,4.55; A3 -3.25,4.55; A4 -2.6,4.55; A5 -1.95,4.55; A6 -1.3,4.55; A7 -0.65,4.55; A8 0,4.55; A9 0.65,4.55; A10 1.3,4.55; A11 1.95,4.55; A12 2.6,4.55; A13 3.25,4.55; A14 3.9,4.55; A15 4.55,4.55; B1 -4.55,3.9; B2 -3.9,3.9; B3 -3.25,3.9; B4 -2.6,3.9; B5 -1.95,3.9; B6 -1.3,3.9; B7 -0.65,3.9; B8 0,3.9; B9 0.65,3.9; B10 1.3,3.9; B11 1.95,3.9; B12 2.6,3.9; B13 3.25,3.9; B14 3.9,3.9; B15 4.55,3.9; C1 -4.55,3.25; C2 -3.9,3.25; C3 -3.25,3.25; C4 -2.6,3.25; C5 -1.95,3.25; C6 -1.3,3.25; C7 -0.65,3.25; C8 0,3.25; C9 0.65,3.25; C10 1.3,3.25; C11 1.95,3.25; C12 2.6,3.25; C13 3.25,3.25; C14 3.9,3.25; C15 4.55,3.25; D1 -4.55,2.6; D2 -3.9,2.6; D3 -3.25,2.6; D4 -2.6,2.6; D5 -1.95,2.6; D6 -1.3,2.6; D7 -0.65,2.6; D8 0,2.6; D9 0.65,2.6; D10 1.3,2.6; D11 1.95,2.6; D12 2.6,2.6; D13 3.25,2.6; D14 3.9,2.6; D15 4.55,2.6; E1 -4.55,1.95; E2 -3.9,1.95; E3 -3.25,1.95; E4 -2.6,1.95; E12 2.6,1.95; E13 3.25,1.95; E14 3.9,1.95; E15 4.55,1.95; F1 -4.55,1.3; F2 -3.9,1.3; F3 -3.25,1.3; F4 -2.6,1.3; F12 2.6,1.3; F13 3.25,1.3; F14 3.9,1.3; F15 4.55,1.3; G1 -4.55,0.65; G2 -3.9,0.65; G3 -3.25,0.65; G4 -2.6,0.65; G12 2.6,0.65; G13 3.25,0.65; G14 3.9,0.65; G15 4.55,0.65; H1 -4.55,0; H2 -3.9,0; H3 -3.25,0; H4 -2.6,0; H12 2.6,0; H13 3.25,0; H14 3.9,0; H15 4.55,0; J1 -4.55,-0.65; J2 -3.9,-0.65; J3 -3.25,-0.65; J4 -2.6,-0.65; J12 2.6,-0.65; J13 3.25,-0.65; J14 3.9,-0.65; J15 4.55,-0.65; K1 -4.55,-1.3; K2 -3.9,-1.3; K3 -3.25,-1.3; K4 -2.6,-1.3; K12 2.6,-1.3; K13 3.25,-1.3; K14 3.9,-1.3; K15 4.55,-1.3; L1 -4.55,-1.95; L2 -3.9,-1.95; L3 -3.25,-1.95; L4 -2.6,-1.95; L12 2.6,-1.95; L13 3.25,-1.95; L14 3.9,-1.95; L15 4.55,-1.95; M1 -4.55,-2.6; M2 -3.9,-2.6; M3 -3.25,-2.6; M4 -2.6,-2.6; M5 -1.95,-2.6; M6 -1.3,-2.6; M7 -0.65,-2.6; M8 0,-2.6; M9 0.65,-2.6; M10 1.3,-2.6; M11 1.95,-2.6; M12 2.6,-2.6; M13 3.25,-2.6; M14 3.9,-2.6; M15 4.55,-2.6; N1 -4.55,-3.25; N2 -3.9,-3.25; N3 -3.25,-3.25; N4 -2.6,-3.25; N5 -1.95,-3.25; N6 -1.3,-3.25; N7 -0.65,-3.25; N8 0,-3.25; N9 0.65,-3.25; N10 1.3,-3.25; N11 1.95,-3.25; N12 2.6,-3.25; N13 3.25,-3.25; N14 3.9,-3.25; N15 4.55,-3.25; P1 -4.55,-3.9; P2 -3.9,-3.9; P3 -3.25,-3.9; P4 -2.6,-3.9; P5 -1.95,-3.9; P6 -1.3,-3.9; P7 -0.65,-3.9; P8 0,-3.9; P9 0.65,-3.9; P10 1.3,-3.9; P11 1.95,-3.9; P12 2.6,-3.9; P13 3.25,-3.9; P14 3.9,-3.9; P15 4.55,-3.9; R1 -4.55,-4.55; R2 -3.9,-4.55; R3 -3.25,-4.55; R4 -2.6,-4.55; R5 -1.95,-4.55; R6 -1.3,-4.55; R7 -0.65,-4.55; R8 0,-4.55; R9 0.65,-4.55; R10 1.3,-4.55; R11 1.95,-4.55; R12 2.6,-4.55; R13 3.25,-4.55; R14 3.9,-4.55; R15 4.55,-4.55; VSS_1 -1.3,1.3; VSS_2 -0.65,1.3; VSS_3 0,1.3; VSS_4 0.65,1.3; VSS_5 1.3,1.3; VSS_6 -1.3,0.65; VSS_7 -0.65,0.65; VSS_8 0,0.65; VSS_9 0.65,0.65; VSS_10 1.3,0.65; VSS_11 -1.3,0; VSS_12 -0.65,0; VSS_13 0,0; VSS_14 0.65,0; VSS_15 1.3,0; VSS_16 -1.3,-0.65; VSS_17 -0.65,-0.65; VSS_18 0,-0.65; VSS_19 0.65,-0.65; VSS_20 1.3,-0.65; VSS_21 -1.3,-1.3; VSS_22 -0.65,-1.3; VSS_23 0,-1.3; VSS_24 0.65,-1.3; VSS_25 1.3,-1.3
S8 = smd 0.762 x 1.143: 1 -1.905,-2.6; 2 -0.635,-2.6; 3 0.635,-2.6; 4 1.905,-2.6; 5 1.905,2.6; 6 0.635,2.6; 7 -0.635,2.6; 8 -1.905,2.6
SO08 = smd 0.66 x 2.032: 1 -1.905,-3.073; 2 -0.635,-3.073; 3 0.635,-3.073; 4 1.905,-3.073; 5 1.905,3.073; 6 0.635,3.073; 7 -0.635,3.073; 8 -1.905,3.073
P1-17 = drill 1.702 pad 2.54 octagon: TP 0,0
DRQ12X = smd 3.85 x 2.5: 1 -4.975,1.5; 2 -4.975,-1.5; 3 4.975,-1.5; 4 4.975,1.5
OPEN-BLDC_MLP33 = smd 0.42 x 0.7: 4G 0.975,-1.4 | smd 1.72 x 0.7: 123S -0.325,-1.4 | smd 2.37 x 2.15: 5678D 0,0.675
3223W = smd 0.9 x 1.6: 1 -1.4,-1.215; 3 1.4,-1.215 | smd 1.3 x 1.3: 2 0,1.215
SOT-223-3 = smd 1.5 x 2: 1 -2.3,-3.15; 2 0,-3.15; 3 2.3,-3.15 | smd 3.8 x 2: 4 0,3.15
DD-8 = smd 0.25 x 0.7: 1 -0.75,-1.4; 2 -0.25,-1.4; 3 0.25,-1.4; 4 0.75,-1.4; 5 0.75,1.4; 6 0.25,1.4; 7 -0.25,1.4; 8 -0.75,1.4 | smd 2.38 x 1.65: 9 0,0
SOIC127P600X175-8N = smd 1.981 x 0.559: 1 -2.464,1.905; 2 -2.464,0.635; 3 -2.464,-0.635; 4 -2.464,-1.905; 5 2.464,-1.905; 6 2.464,-0.635; 7 2.464,0.635; 8 2.464,1.905
SOT95P280X145-5N = smd 1.27 x 0.559: 1 -1.295,0.94; 2 -1.295,0; 3 -1.295,-0.94; 4 1.295,-0.94; 5 1.295,0.94
SIL0008D = smd 0.5 x 0.4: 1 -1.05,0.975; 2 -1.05,0.325; 3 -1.05,-0.325; 4 -1.05,-0.975; 5 1.05,-0.975; 6 1.05,-0.325; 7 1.05,0.325; 8 1.05,0.975 | smd 1.1 x 1.9: TP 0,0
SOT95P237X112-3N = smd 1.321 x 0.559: 1 -1.092,0.94; 2 -1.092,-0.94 | smd 1.321 x 0.508: 3 1.092,0
S-PWSON-N6 = smd 0.4 x 0.95: 1 -0.95,-1.425; 2 0,-1.425; 3 0.95,-1.425; 4 0.95,1.425; 5 0,1.425; 6 -0.95,1.425 | smd 2 x 1.3: TP 0,0

### Placement (x,y rotation side)
ADC1  11.18,45.21 0 top
C1  10.41,16.51 90 top
C2  15.62,10.54 180 top
C3  14.48,22.73 180 top
C4  19.81,16.51 90 top
C5  24.13,17.91 90 top
C6  1.52,47.24 270 top
C7  7.11,41.4 180 top
C8  7.37,38.35 180 top
C9  7.37,39.75 180 top
C10  10.48,38.61 180 top
C11  12.57,40.51 270 top
C12  72.01,48.77 0 top
C13  70.61,43.18 0 top
C14  73.41,45.97 90 top
C15  68.83,4.06 270 top
C16  71.63,1.27 0 top
C17  74.42,2.67 270 top
C18  33.15,46.99 0 top
C19  27.69,33.02 90 top
C20  21.59,32 270 top
C21  31.37,28.07 90 top
C22  27.3,35.05 180 top
C23  15.37,32.26 270 top
C24  16.38,33.15 270 top
C25  33.15,45.59 0 top
C26  15.88,37.21 180 top
C27  15.88,39.62 180 top
D1  37.46,31.5 180 top
IC1  30.23,6.99 0 top
IC2  3.43,4.45 180 top
IC3  15.11,16.51 0 top
IOUT+  1.91,29.46 90 top
IOUT-  1.91,33.27 90 top
L1  20.45,43.81 180 bottom
Q1  30.1,45.59 0 top
R1  3.43,9.4 0 top
R2  3.43,10.67 0 top
R3  3.43,11.94 0 top
R4  3.43,13.21 0 top
R5  3.43,14.48 0 top
R6  3.43,15.75 0 top
R7  3.43,17.02 0 top
R8  4.38,19.56 270 top
R9  2.92,23.24 0 top
R10  8.89,23.5 0 top
R11  9.14,31.88 0 top
R12  4.57,28.57 90 top
R13  6.6,31.88 180 top
R14  3.3,47.24 90 top
R15  7.37,45.34 0 top
R16  7.37,43.05 0 top
R17  4.95,40.64 90 top
R18  9.78,40.51 90 top
R19  11.18,40.51 90 top
R20  66.42,46.1 90 top
R21  68.07,46.86 90 top
R22  68.07,44.45 90 top
R23  71.75,8.25 0 top
R24  72.52,6.6 0 top
R25  70.1,6.6 0 top
R26  26.67,33.02 270 top
R27  28.7,33.02 90 top
R28  27.3,34.16 180 top
R29  23.11,32.38 180 top
R30  23.11,31.5 0 top
R31  31.24,41.4 180 top
R32  18.41,32.26 270 top
R33  19.43,32.26 90 top
R34  17.4,32.26 270 top
REG1  21.59,26.42 0 top
SENSE+  1.91,37.08 90 top
SENSE-  1.91,40.89 90 top
U1  11.94,7.37 270 top
U2  9.91,28.45 0 top
U3  6.6,47.75 180 top
U4  71.37,3.81 90 top
U5  70.87,45.72 180 top
U6  10.48,35.94 90 top
U7  4.32,43.94 270 top
U8  29.97,23.88 90 top
U9  22.61,34.67 270 top

### Tracks (layer width: path | path; a pad name or v marks a point on that pad's centre or on a via)
3.3V  (18 unrouted)
  pour Top (no thermals): 72.39,8.89 72.39,5.27 72.2,5.08 72.2,4.64 72.71,4.64 72.71,2.98 72.2,2.98 72.2,2.54 74.55,2.54 75.31,3.3 75.31,8.13 74.55,8.89
5V
  pour Top (no thermals): 65.79,46.74 69.41,46.74 69.6,46.55 70.04,46.55 70.04,47.05 71.69,47.05 71.69,46.55 72.14,46.55 72.14,48.9 71.37,49.66 66.55,49.66 65.79,48.9
5V_FB  (2 unrouted)
5V_PG  (1 unrouted)
5V_SS  (1 unrouted)
+5V  (3 unrouted)
  pour Top (no thermals): 13.02,8.51 13.02,6.22 14.48,6.22 14.73,6.48 14.73,8.25 14.48,8.51
  pour Route3: 24.77,21.46 16.89,21.46 16.89,24 14.99,24 14.99,18.92 20.45,18.92 20.45,11.3 17.65,8.51 12.95,8.51 12.95,6.22 18.29,6.22 22.61,10.54 22.61,18.92 24.77,18.92
  pour Top (no thermals): 23.11,24.26 23.11,19.05 23.5,18.67 24.77,18.67 24.77,24.26
+10V  (1 unrouted)
  pour Top (rank 2, no thermals): 12.95,18.54 12.95,19.68 11.43,21.21 9.91,21.21 9.91,23.11 10.92,24.13 13.97,24.13 13.97,21.46 13.59,21.08 13.59,18.54
  pour Top (no thermals): 13.33,29.34 11.56,29.34 11.3,29.59 9.91,29.59 9.78,29.46 9.78,28.7 9.91,28.57 11.3,28.57 11.56,28.83 13.33,28.83
  pour Route3 (no thermals): 9.78,29.59 9.65,29.46 9.65,21.21 11.3,21.21 11.94,20.57 12.83,20.57 12.83,24.13 12.06,24.13 11.43,24.77 11.43,29.34 11.18,29.59
-10V  (2 unrouted)
  pour Top (rank 2, no thermals): 16.76,12.45 19.56,12.45 21.08,13.97 21.08,16 16.76,16
  pour Top (no thermals): 6.98,23.11 8.89,23.11 8.89,20.57 6.98,20.57
  pour Top (no thermals): 8.38,26.8 6.6,26.8 6.35,27.05 4.83,27.05 4.7,26.92 4.7,26.16 4.83,26.04 6.35,26.04 6.6,26.29 8.38,26.29
  pour Route3 (no thermals): 18.29,16 10.29,16 8.76,17.53 8.76,26.29 8,27.05 4.7,27.05 4.57,26.92 4.57,26.16 4.7,26.04 6.1,26.04 6.6,25.53 6.6,16 10.16,12.45 18.29,12.45
ADC1_AINP
  Top 0.254: ADC1.3 11.18,41.27 | 11.18,41.27 R19.P$2 | R18.P$2 11.16,41.26 | 11.16,41.26 11.18,41.27 | C11.P$1 11.16,41.26
ADC1_REF
  Top 0.254: C8.P$1 C9.P$1 8.06,39.8 C7.1 8.06,43 R16.P$2 8.16,43.01 ADC1.1
ADC_BUF_IN+  (1 unrouted)
  Top 0.254: U2.6 14.1,27.81 14.86,28.57 14.86,30.86 11.42,34.3 U6.3
ADC_BUF_IN-
  Top 0.254: R19.P$1 11.18,38.66 C10.P$1 11.23,38.3 11.43,38.1 U6.4
ADC_BUF_OUT
  Top 0.254: R18.P$1 9.78,38.66 C10.P$2 10.48,37.86 10.48,36.51 9.53,35.56 9.53,34.66 U6.1
BATT+  (4 unrouted)
  pour Top (no thermals): 71.69,45.21 72.26,45.21 72.77,44.7 72.77,44.07 73.15,43.69 74.04,43.69 74.04,45.59 71.69,45.59
  pour Top (no thermals): 70.87,2.98 70.87,2.41 70.36,1.91 69.72,1.91 69.34,1.52 69.34,0.64 71.25,0.64 71.25,2.98
  pour Top (no thermals): 22.48,42.8 18.03,42.8 16.89,41.66 16.89,36.32 16.89,36.07 17.78,36.07 18.92,36.07 19.43,35.56 21.08,35.56 22.48,35.56
CC
  pour Top (no thermals): 1.14,6.48 0.13,6.48 0.13,29.97 1.14,30.99 2.54,30.99 3.3,30.23 3.3,28.83 2.67,28.19 2.67,26.16 3.56,25.27 3.56,24 2.92,23.37 2.92,8.64 1.91,7.62 1.91,6.48
CC_OUT  (11 unrouted)
GATE_BOOST_OUT  (1 unrouted)
GATE_COMP  (2 unrouted)
GATE_CS  (1 unrouted)
GATE_FB  (4 unrouted)
GATE_SS  (1 unrouted)
GATE_UVLO  (2 unrouted)
GATE_VDD  (3 unrouted)
GND  (78 unrouted)
  Top 0.254: ADC1.4 ADC1.5
  pour Top (no thermals): 32.26,44.7 32.26,40.13 35.69,40.13 35.69,43.56 34.54,44.7
INDUCT_OUT  (1 unrouted)
  pour Top (no thermals): 33.4,50.04 38.23,50.04 39.37,48.9 39.37,37.59 36.2,37.59 36.2,43.81 34.8,45.21 33.4,45.21
  pour Top (no thermals): 23.5,43.56 23.5,39.24 26.92,35.81 39.37,35.81 39.37,39.62 27.69,39.62 27.69,43.56
MEAS_NEG  (1 unrouted)
MEAS_POS  (1 unrouted)
MOS_OUT  (1 unrouted)
  pour Top (no thermals): 23.5,49.28 24.26,50.04 32.89,50.04 32.89,45.21 28.83,45.21 27.69,44.07 23.5,44.07
N$1  (1 unrouted)
N$2  (1 unrouted)
N$3  (1 unrouted)
N$4  (1 unrouted)
N$5  (1 unrouted)
N$6  (1 unrouted)
N$7  (1 unrouted)
N$9  (2 unrouted)
N$10  (1 unrouted)
N$12  (1 unrouted)
N$14  (2 unrouted)
N$15  (1 unrouted)
N$16  (1 unrouted)
N$19  (2 unrouted)
N$20  (1 unrouted)
  pour Top (no thermals): 29.08,44.7 28.19,43.81 28.19,40.13 30.61,40.13 30.61,44.7
N$21  (1 unrouted)
N$23  (1 unrouted)
N$28  (1 unrouted)
REF_BUF_IN+
  Top 0.254: C6.P$1 R14.P$2 6.21,47.99 6.91,48.69 U3.3
REF_BUF_IN-  (1 unrouted)
REF_BUF_OUT
  Top 0.254: R16.P$1 6.62,43.95 6.73,44.07 8,44.07 8.13,44.2 8.12,44.21 R15.P$2 8.12,46.6 U3.1
REF_OUT
  Top 0.254: U7.2 3.38,46.42 R14.P$1